# EAGLE design AD1865.2 (EAGLE 5.07)
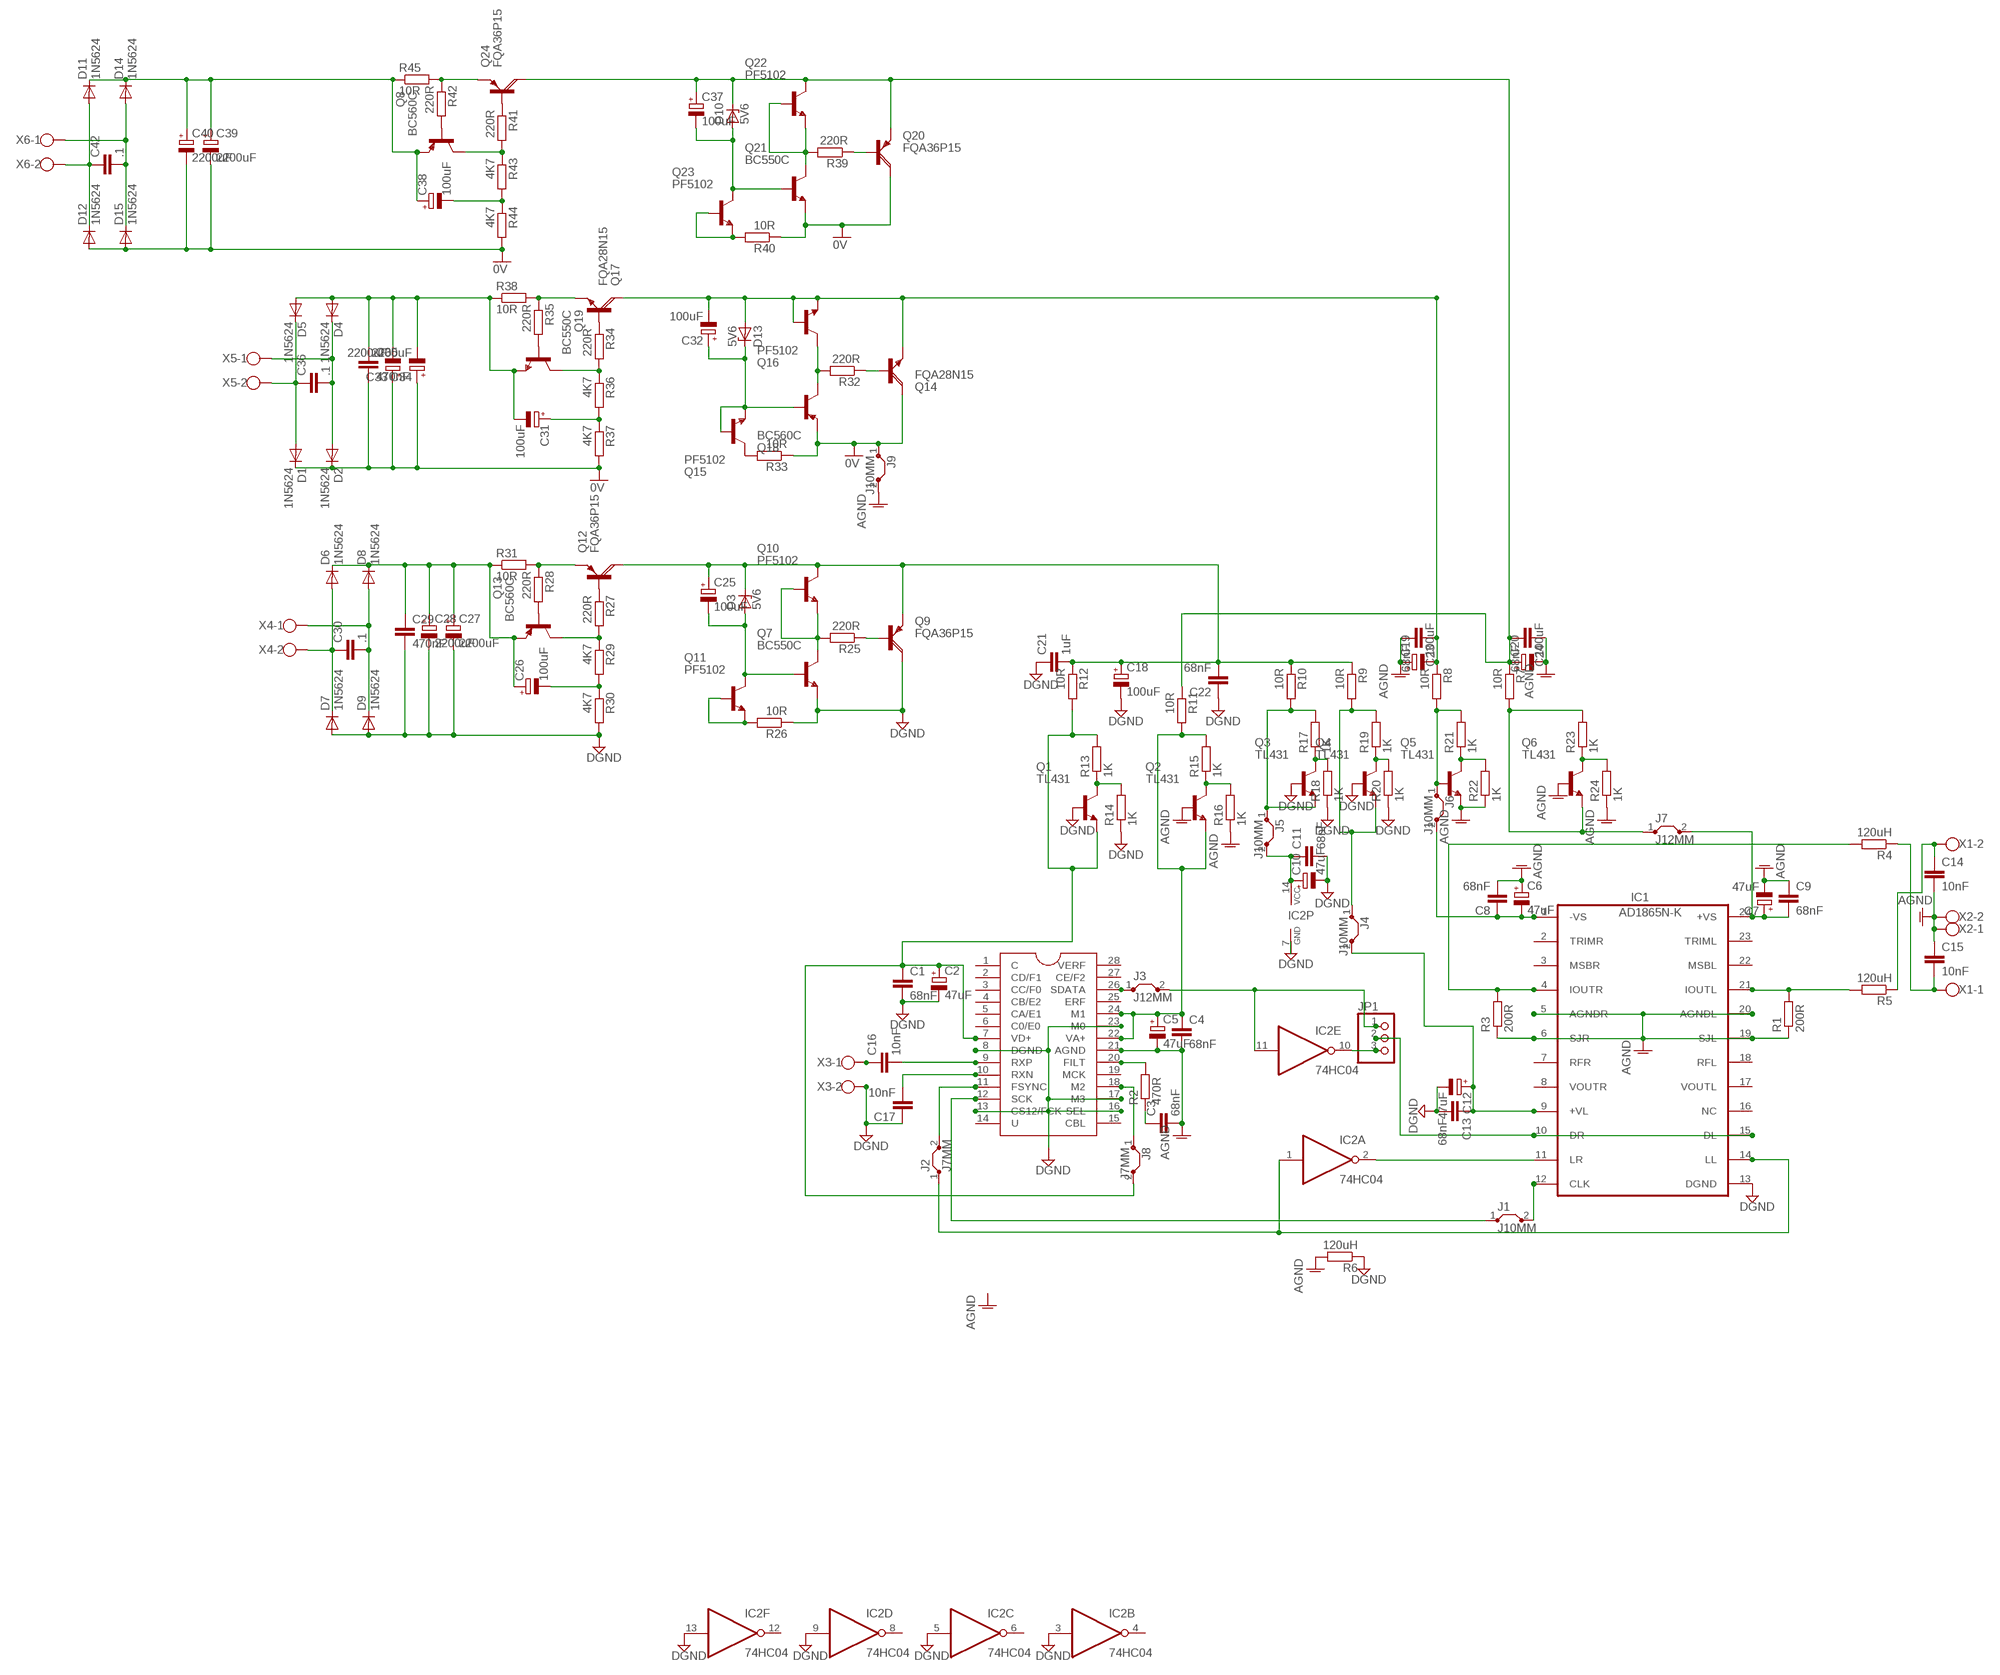
[diagram p0: schematic, sheet 1]

## Parts
C1  68nF  C-EU050-035X075  [C050-035X075]
C2  47uF  CPOL-EUTAP5-80  [TAP5-80]
C3  68nF  C-EU050-035X075  [C050-035X075]
C4  68nF  C-EU050-035X075  [C050-035X075]
C5  47uF  CPOL-EUTAP5-80  [TAP5-80]
C6  47uF  CPOL-EUTAP5-80  [TAP5-80]
C7  47uF  CPOL-EUTAP5-80  [TAP5-80]
C8  68nF  C-EU050-035X075  [C050-035X075]
C9  68nF  C-EU050-035X075  [C050-035X075]
C10  47uF  CPOL-EUTAP5-80  [TAP5-80]
C11  68nF  C-EU050-035X075  [C050-035X075]
C12  47uF  CPOL-EUTAP5-80  [TAP5-80]
C13  68nF  C-EU050-035X075  [C050-035X075]
C14  10nF  C-EU150-072X183  [C150-072X183]
C15  10nF  C-EU150-072X183  [C150-072X183]
C16  10nF  C-EU102-043X133  [C102-043X133]
C17  10nF  C-EU102-043X133  [C102-043X133]
C18  100uF  CPOL-EUE7.5-16  [E7,5-16]
C19  100uF  CPOL-EUE7.5-16  [E7,5-16]
C20  100uF  CPOL-EUE7.5-16  [E7,5-16]
C21  1uF  C-EU275-093X316  [C275-093X316]
C22  68nF  C-EU050-035X075  [C050-035X075]
C23  68nF  C-EU050-035X075  [C050-035X075]
C24  68nF  C-EU050-035X075  [C050-035X075]
C25  100uF  CPOL-EUTAP5-80  [TAP5-80]
C26  100uF  CPOL-EUTAP5-80  [TAP5-80]
C27  2200uF  CPOL-EUE10-20  [EB20D]
C28  2200uF  CPOL-EUE10-20  [EB20D]
C29  470nF  C-EU102-043X133  [C102-043X133]
C30  .1  C-EU102-043X133  [C102-043X133]
C31  100uF  CPOL-EUTAP5-80  [TAP5-80]
C32  100uF  CPOL-EUTAP5-80  [TAP5-80]
C33  2200uF  CPOL-EUE10-20  [EB20D]
C34  2200uF  CPOL-EUE10-20  [EB20D]
C35  470nF  C-EU102-043X133  [C102-043X133]
C36  .1  C-EU102-043X133  [C102-043X133]
C37  100uF  CPOL-EUTAP5-80  [TAP5-80]
C38  100uF  CPOL-EUTAP5-80  [TAP5-80]
C39  2200uF  CPOL-EUE10-20  [EB20D]
C40  2200uF  CPOL-EUE10-20  [EB20D]
C42  .1  C-EU075-052X106  [C075-052X106]
D1  1N5624  [DO201-15]
D2  1N5624  [DO201-15]
D3  5V6  1N821  [DO35Z10]
D4  1N5624  [DO201-15]
D5  1N5624  [DO201-15]
D6  1N5624  [DO201-15]
D7  1N5624  [DO201-15]
D8  1N5624  [DO201-15]
D9  1N5624  [DO201-15]
D10  5V6  1N821  [DO35Z10]
D11  1N5624  [DO201-15]
D12  1N5624  [DO201-15]
D13  5V6  1N821  [DO35Z10]
D14  1N5624  [DO201-15]
D15  1N5624  [DO201-15]
IC1  AD1865N-K  AD1865  [DIL24-6]
IC2  74HC04  74HC04N  [DIL14]
J1  J10MM  [10]
J2  J7MM  [07]
J3  J12MM  [12]
J4  J10MM  [10]
J5  J10MM  [10]
J6  J10MM  [10]
J7  J12MM  [12]
J8  J7MM  [07]
J9  J10MM  [10]
JP1  PINHD-1X3  [1X03]
Q1  TL431  BC546A  [TO92-EBC]
Q2  TL431  BC546A  [TO92-EBC]
Q3  TL431  BC546A  [TO92-EBC]
Q4  TL431  BC546A  [TO92-EBC]
Q5  TL431  BC546A  [TO92-EBC]
Q6  TL431  BC546A  [TO92-EBC]
Q7  BC550C  BC550B  [TO92-EBC]
Q8  BC560C  [TO92-EBC]
Q9  FQA36P15  TIP147  [SOT93]
Q10  PF5102  BC550B  [TO92-EBC]
Q11  PF5102  BC550B  [TO92-EBC]
Q12  FQA36P15  TIP147  [SOT93]
Q13  BC560C  [TO92-EBC]
Q14  FQA28N15  TIP142  [SOT93]
Q15  PF5102  BC550B  [TO92-EBC]
Q16  PF5102  BC550B  [TO92-EBC]
Q17  FQA28N15  TIP142  [SOT93]
Q18  BC560C  [TO92-EBC]
Q19  BC550C  BC550B  [TO92-EBC]
Q20  FQA36P15  TIP147  [SOT93]
Q21  BC550C  BC550B  [TO92-EBC]
Q22  PF5102  BC550B  [TO92-EBC]
Q23  PF5102  BC550B  [TO92-EBC]
Q24  FQA36P15  TIP147  [SOT93]
R1  200R  R-EU_0309/12  [0309/12]
R2  470R  R-EU_0204/7  [0204/7]
R3  200R  R-EU_0309/12  [0309/12]
R4  120uH  R-EU_0309/12  [0309/12]
R5  120uH  R-EU_0309/12  [0309/12]
R6  120uH  R-EU_0309/12  [0309/12]
R7  10R  R-EU_0309/12  [0309/12]
R8  10R  R-EU_0309/12  [0309/12]
R9  10R  R-EU_0309/12  [0309/12]
R10  10R  R-EU_0309/12  [0309/12]
R11  10R  R-EU_0309/12  [0309/12]
R12  10R  R-EU_0309/12  [0309/12]
R13  1K  R-EU_0204/7  [0204/7]
R14  1K  R-EU_0204/7  [0204/7]
R15  1K  R-EU_0204/7  [0204/7]
R16  1K  R-EU_0204/7  [0204/7]
R17  1K  R-EU_0204/7  [0204/7]
R18  1K  R-EU_0204/7  [0204/7]
R19  1K  R-EU_0204/7  [0204/7]
R20  1K  R-EU_0204/7  [0204/7]
R21  1K  R-EU_0204/7  [0204/7]
R22  1K  R-EU_0204/7  [0204/7]
R23  1K  R-EU_0204/7  [0204/7]
R24  1K  R-EU_0204/7  [0204/7]
R25  220R  R-EU_0204/7  [0204/7]
R26  10R  R-EU_0204/7  [0204/7]
R27  220R  R-EU_0204/7  [0204/7]
R28  220R  R-EU_0204/7  [0204/7]
R29  4K7  R-EU_0204/7  [0204/7]
R30  4K7  R-EU_0207/10  [0207/10]
R31  10R  R-EU_0414/15  [0414/15]
R32  220R  R-EU_0204/7  [0204/7]
R33  10R  R-EU_0204/7  [0204/7]
R34  220R  R-EU_0204/7  [0204/7]
R35  220R  R-EU_0204/7  [0204/7]
R36  4K7  R-EU_0204/7  [0204/7]
R37  4K7  R-EU_0207/10  [0207/10]
R38  10R  R-EU_0414/15  [0414/15]
R39  220R  R-EU_0207/10  [0207/10]
R40  10R  R-EU_0204/7  [0204/7]
R41  220R  R-EU_0204/7  [0204/7]
R42  220R  R-EU_0204/7  [0204/7]
R43  4K7  R-EU_0204/7  [0204/7]
R44  4K7  R-EU_0207/10  [0207/10]
R45  10R  R-EU_0414/15  [0414/15]
U$1  CS8414  CS8414DIP  [DIL28]
X1  W237-02P  [W237-132]
X2  W237-02P  [W237-132]
X3  W237-02P  [W237-132]
X4  W237-02P  [W237-132]
X5  W237-02P  [W237-132]
X6  W237-02P  [W237-132]

## Nets
0V: C33.+ C34.+ C35.2 C39.- C40.- D1.C D2.C D12.A D15.A J9.1 Q14.C Q18.E Q20.C Q21.E R33.1 R37.2 R40.1 R44.2
AGND: C3.2 C4.2 C5.- C6.+ C7.- C8.2 C9.1 C14.2 C15.1 C19.+ C20.- C23.2 C24.1 IC1.5(AGNDR) IC1.6(SJR) IC1.19(SJL) IC1.20(AGNDL) J9.2 Q2.B Q5.E Q6.B R1.1 R3.1 R6.2 R16.1 R22.1 R24.1 U$1.21(AGND) X2.1 X2.2
DGND: C1.2 C2.- C10.- C11.2 C12.- C13.2 C17.1 C18.- C21.1 C22.1 C27.- C28.- C29.2 D7.A D9.A IC1.13(DGND) IC2.3(B:I) IC2.5(C:I) IC2.7(P:GND) IC2.9(D:I) IC2.13(F:I) Q1.B Q3.B Q4.B Q7.E Q9.C R6.1 R14.1 R18.1 R20.1 R26.1 R30.2 U$1.8(DGND) U$1.13(CS12/FCK) U$1.16(SEL) U$1.17(M3) U$1.23(M0) X3.2
N$1: R2.2 U$1.20(FILT)
N$2: IC1.10(DR) IC1.15(DL) JP1.2
N$3: C3.1 R2.1
N$5: IC1.11(LR) IC2.2(A:O)
N$6: IC1.14(LL) IC2.1(A:I) J2.1
N$7: J1.1 U$1.12(SCK)
N$8: IC1.12(CLK) J1.2
N$9: J2.2 U$1.11(FSYNC)
N$10: IC2.11(E:I) J3.2 JP1.1
N$11: IC2.10(E:O) JP1.3
N$12: J5.1 Q3.E R10.2 R17.2
N$13: C19.- C23.1 C32.- D13.A Q14.E Q16.B Q16.E Q17.C R8.1
N$14: J3.1 U$1.26(SDATA)
N$15: C6.- C8.1 IC1.1(-VS) J6.2
N$16: C7.+ C9.2 IC1.24(+VS) J7.2
N$17: C1.1 C2.+ J8.2 Q1.E R12.2 R13.2 U$1.7(VD+)
N$18: IC1.21(IOUTL) R1.2 R5.2
N$19: C10.+ C11.1 IC2.14(P:VCC) J5.2
N$20: IC1.4(IOUTR) R3.2 R4.2
N$21: C14.1 R5.1 X1.2
N$22: C15.2 R4.1 X1.1
N$23: C17.2 U$1.10(RXN)
N$24: C16.2 U$1.9(RXP)
N$25: C16.1 X3.1
N$26: C12.+ C13.1 IC1.9(+VL) J4.2
N$27: J7.1 Q6.E R7.2 R23.2
N$28: J6.1 Q5.B R8.2 R21.2
N$29: Q5.C R21.1 R22.2
N$30: J8.1 U$1.18(M2)
N$31: Q1.C R13.1 R14.2
N$32: C4.1 C5.+ Q2.E R11.2 R15.2 U$1.22(VA+) U$1.24(M1)
N$33: Q2.C R15.1 R16.2
N$34: Q3.C R17.1 R18.2
N$35: Q8.B R42.2
N$36: Q4.C R19.1 R20.2
N$37: Q6.C R23.1 R24.2
N$38: C20.+ C24.2 C37.+ D10.C Q20.E Q22.C Q24.C R7.1 R11.1
N$39: C18.+ C21.2 C22.2 C25.+ D3.C Q9.E Q10.C Q12.C R9.1 R10.1 R12.1
N$40: Q9.B R25.1
N$41: Q17.E R35.1 R38.2
N$42: Q12.E R28.1 R31.2
N$43: Q7.C Q10.B Q10.E R25.2
N$44: C25.- D3.A Q7.B Q11.C
N$45: Q11.B Q11.E R26.2
N$46: Q12.B R27.1
N$47: Q17.B R34.1
N$48: Q13.C R27.2 R29.1
N$49: Q13.B R28.2
N$50: C26.- R29.2 R30.1
N$51: C26.+ C27.+ C28.+ C29.1 D6.C D8.C Q13.E R31.1
N$52: C30.2 D8.A D9.C X4.1
N$53: C30.1 D6.A D7.C X4.2
N$54: Q19.B R35.2
N$55: Q14.B R32.1
N$56: Q19.C R34.2 R36.1
N$57: Q16.C Q18.C R32.2
N$58: C32.+ D13.C Q15.B Q15.E Q18.B
N$59: Q15.C R33.2
N$60: C31.- C33.- C34.- C35.1 D4.A D5.A Q19.E R38.1
N$61: C31.+ R36.2 R37.1
N$62: J4.1 Q4.E R9.2 R19.2
N$63: C36.2 D2.A D4.C X5.1
N$64: C36.1 D1.A D5.C X5.2
N$65: Q20.B R39.1
N$66: Q21.C Q22.B Q22.E R39.2
N$67: C37.- D10.A Q21.B Q23.C
N$68: Q23.B Q23.E R40.2
N$69: Q24.E R42.1 R45.2
N$70: Q24.B R41.1
N$71: Q8.C R41.2 R43.1
N$73: C38.- R43.2 R44.1
N$74: C38.+ C39.+ C40.+ D11.C D14.C Q8.E R45.1
N$75: C42.2 D14.A D15.C X6.1
N$76: C42.1 D11.A D12.C X6.2
Unconnected: IC1.2(TRIMR) IC1.3(MSBR) IC1.7(RFR) IC1.8(VOUTR) IC1.16(NC) IC1.17(VOUTL) IC1.18(RFL) IC1.22(MSBL) IC1.23(TRIML) IC2.4(B:O) IC2.6(C:O) IC2.8(D:O) IC2.12(F:O) U$1.1(C) U$1.2(CD/F1) U$1.3(CC/F0) U$1.4(CB/E2) U$1.5(CA/E1) U$1.6(C0/E0) U$1.14(U) U$1.15(CBL) U$1.19(MCK) U$1.25(ERF) U$1.27(CE/F2) U$1.28(VERF)

## Library data of the parts
C1 C3 C4 C8 C9 C11 C13-C17 C21-C24 C29 C30 C35 C36 C42 = resistor:C-EU: CAPACITOR, European symbol
C2 C5-C7 C10 C12 C18-C20 C25-C28 C31-C34 C37-C40 = resistor:CPOL-EU: POLARIZED CAPACITOR, European symbol
D1 D2 D4-D9 D11 D12 D14 D15 = diode:1N5624: DIODE controlled avalanche rectifier
D3 D10 D13 = diode:1N821: Reference DIODE temperature compensated, 6,2 V
IC1 = pavouk:AD1865: Complete Dual 18-Bit 16xFS Audio DAC
IC2 = 74xx-eu:74*04: Hex INVERTER
J1-J9 = jumper:J: Bridge
JP1 = pinhead:PINHD-1X3: PIN HEADER
Q1-Q6 = transistor-npn:BC546*: NPN Transistor
Q7 Q10 Q11 Q15 Q16 Q19 Q21-Q23 = transistor-npn:BC550*: NPN Transistor
Q8 Q13 Q18 = transistor-pnp:BC560*: PNP Transistror
Q9 Q12 Q20 Q24 = transistor-power:TIP147: PNP DARLINGTON TRANSISTOR
Q14 Q17 = transistor-power:TIP142: NPN DARLINGTON TRANSISTOR
R1-R45 = resistor:R-EU_: RESISTOR, European symbol
U$1 = cirrus-dar:CS8414: 24bit 96kHz Digital Audio Receiver
X1-X6 = con-wago-508:W237-02P: WAGO SREW CLAMP

## Board
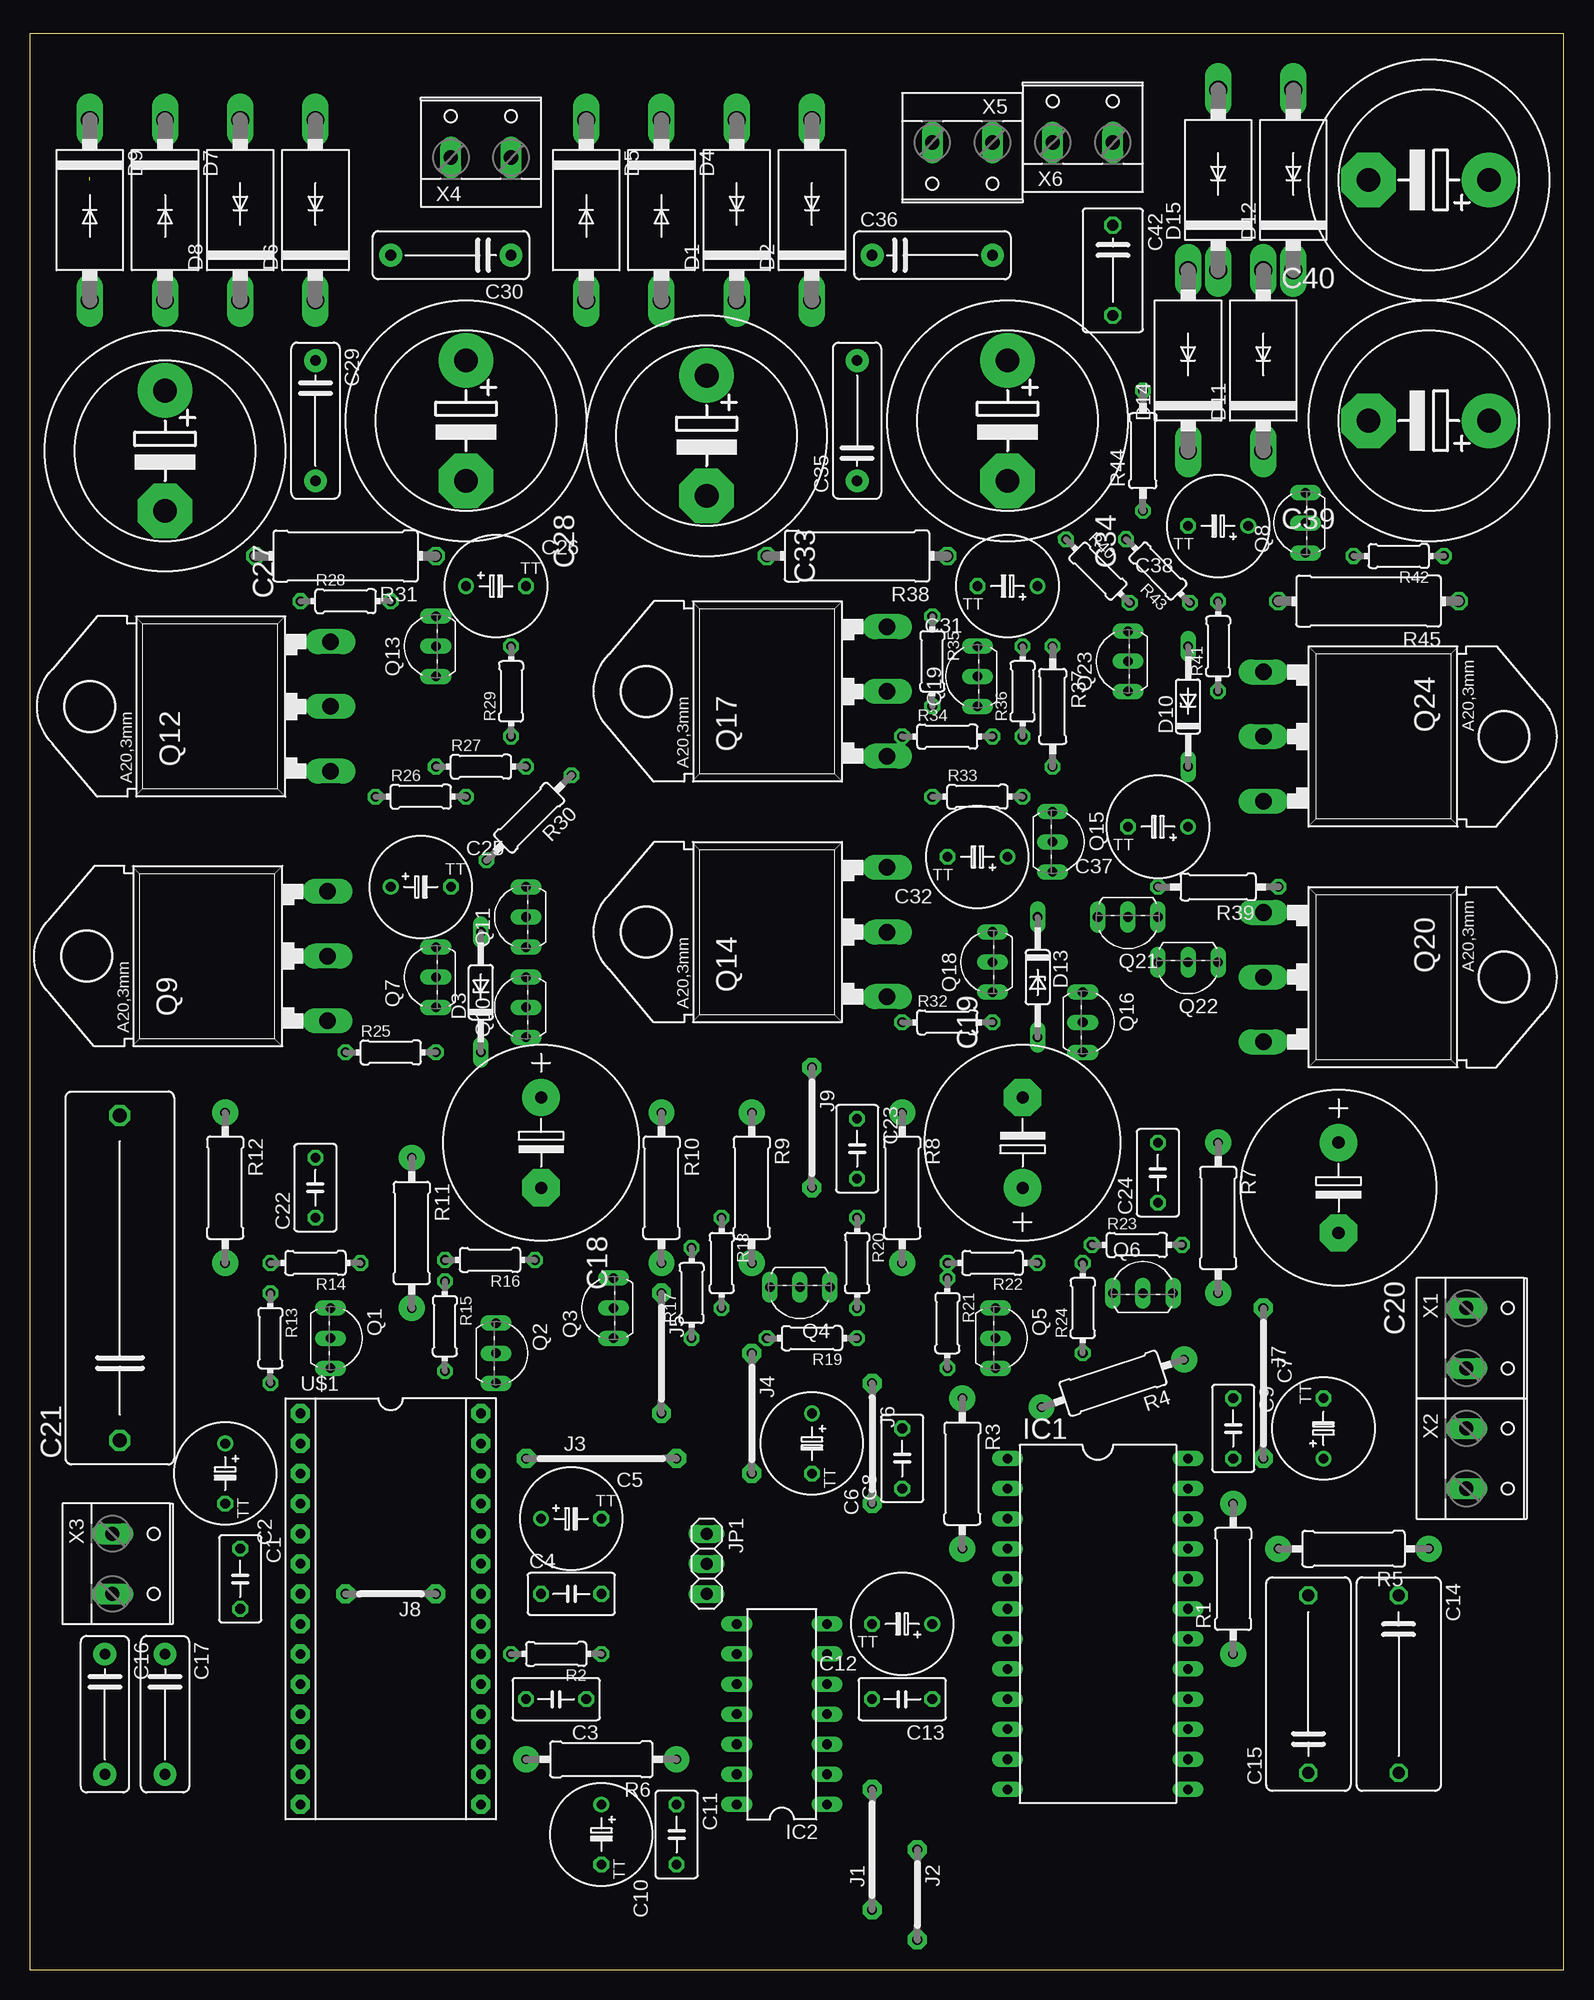
[diagram p1: board, top side]
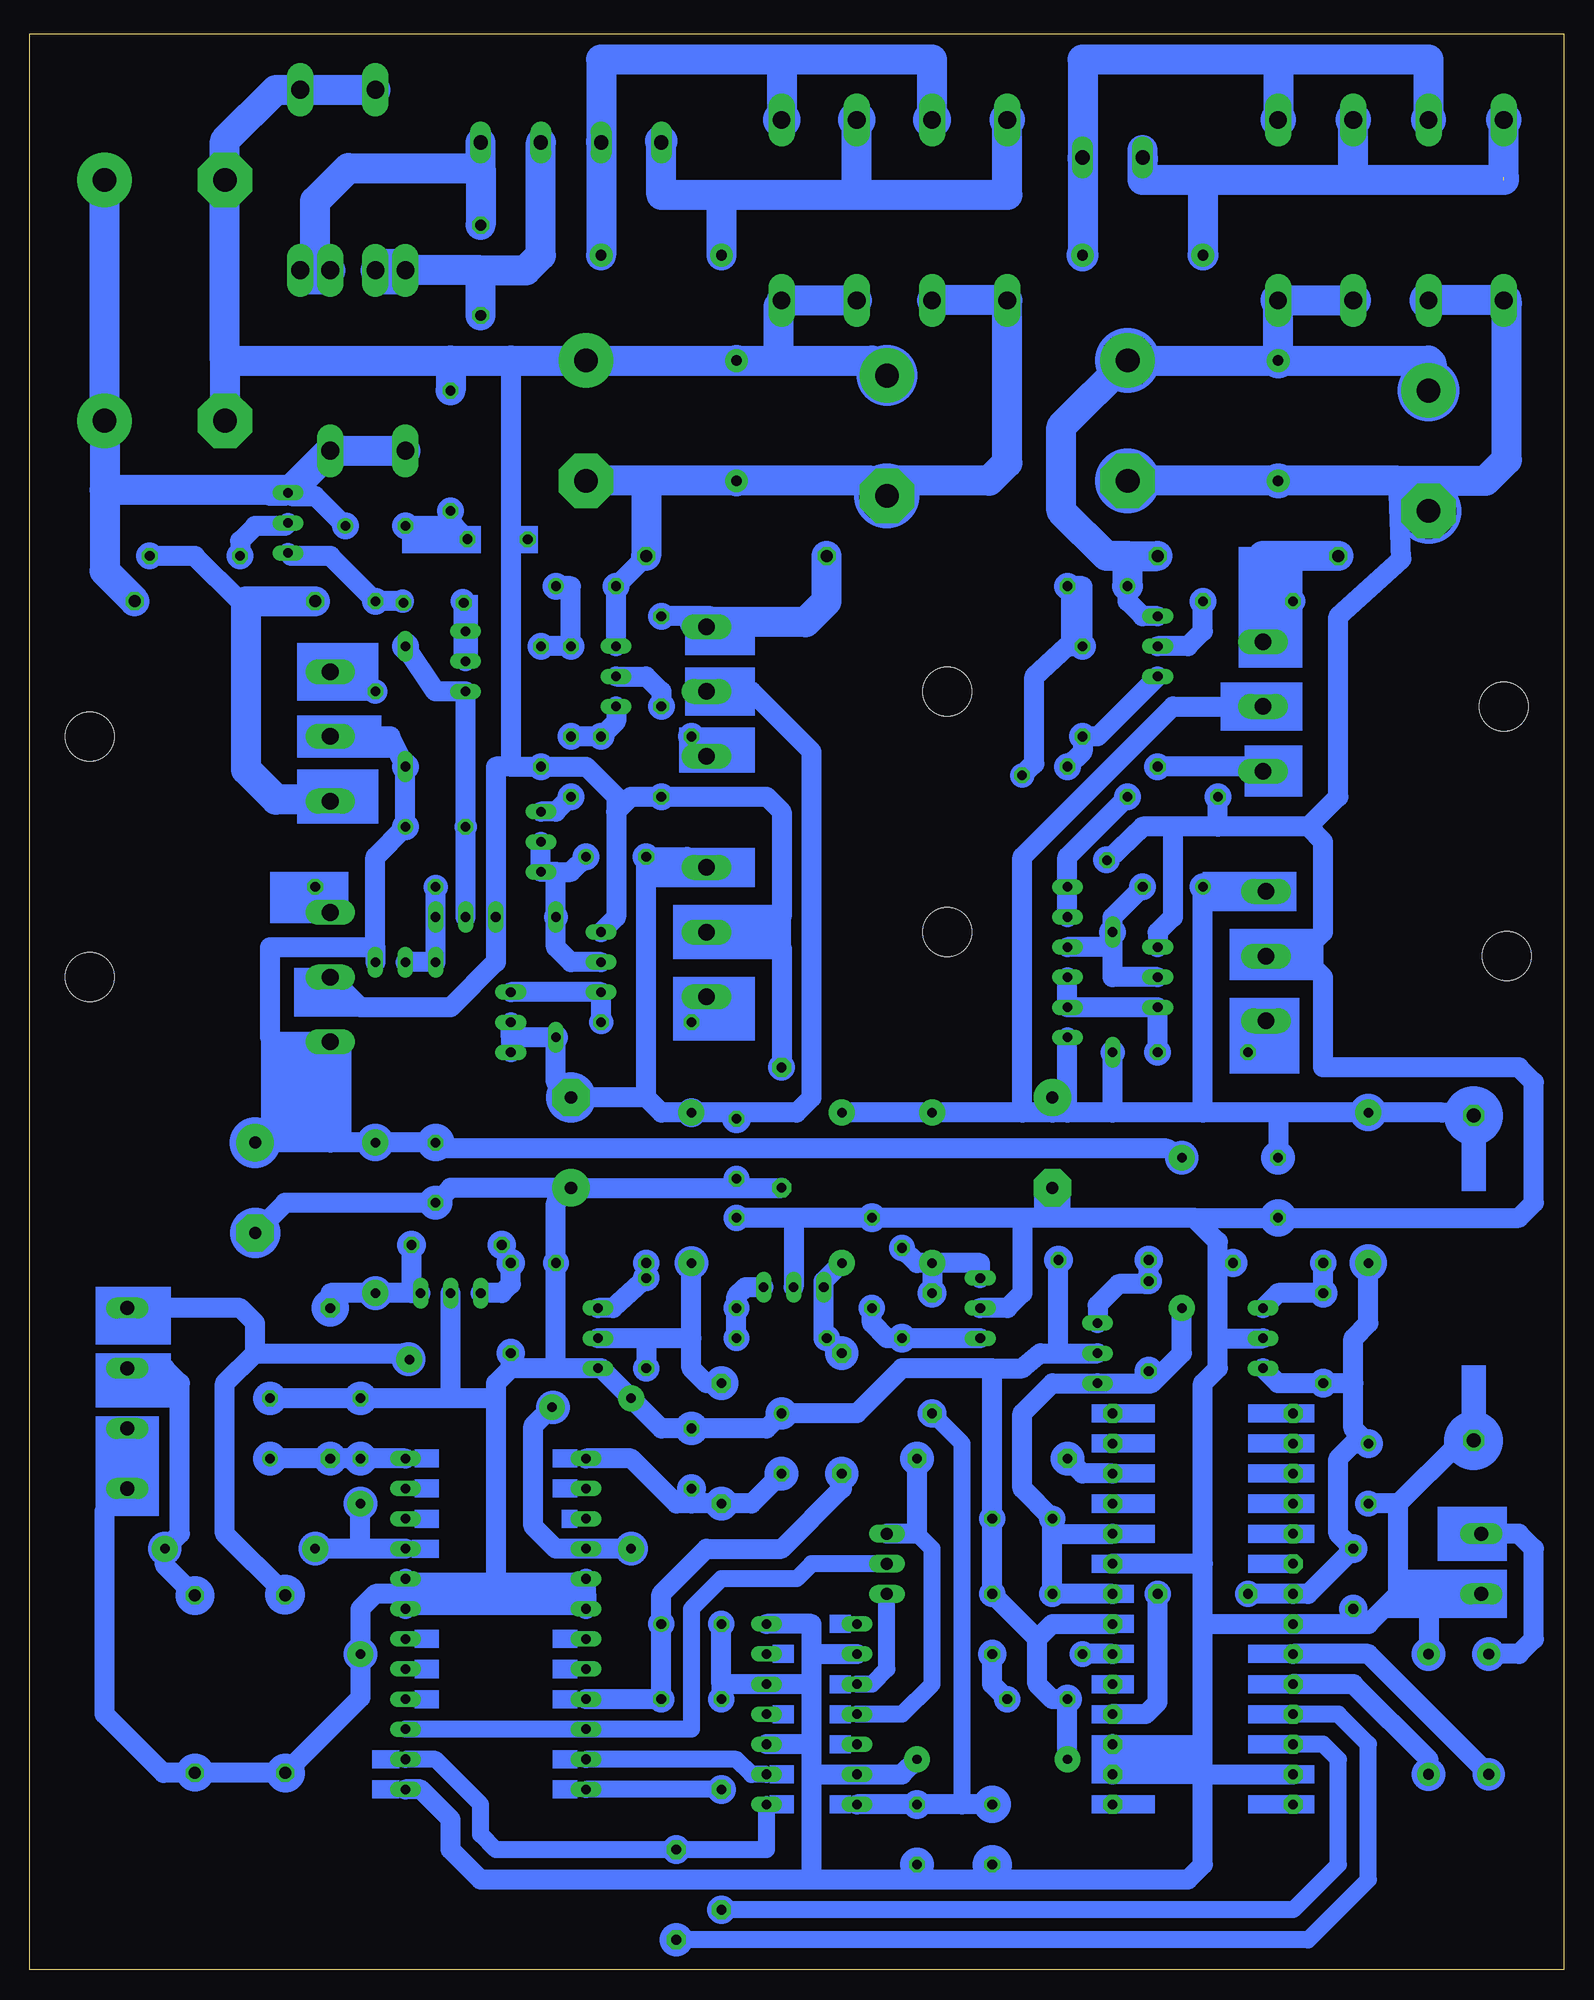
[diagram p2: board, bottom side, seen from below]

Size 129.52 x 163.5 mm. Coordinates in mm from the lower left corner, seen from the top.
Outline: 0,0 129.52,0 129.52,163.5 0,163.5 0,0
Copper layers (1*16): Top 0.035mm / dielectric 1.5mm / Bottom 0.035mm
Design rules "default": minimum track width 10mil, minimum drill 24mil, track to track 8mil, track to pad 8mil, pad to pad 8mil, via to via 8mil, smd to smd 8mil, copper to edge 40mil, drill to drill 8mil, minimum pad ring 10mil, minimum via ring 8mil, stop-mask expansion 4mil, vias tented up to drill 0mil, thermal gap 10mil

### Footprints (pad centres in the part's own frame; a part is rotated, then mirrored left to right if it is on the bottom)
C050-035X075 = drill 0.813 octagon: 1 -2.54,0; 2 2.54,0
TAP5-80 = drill 0.813: + -2.54,0 | drill 0.813 octagon: - 2.54,0
C150-072X183 = drill 1.016 octagon: 1 -7.493,0; 2 7.493,0
C102-043X133 = drill 0.9 pad 1.93: 1 -5.08,0; 2 5.08,0
E7,5-16 = drill 1.016 pad 3.15: + -3.81,0 | drill 1.016 pad 3.15 octagon: - 3.81,0
C275-093X316 = drill 1.194 octagon: 1 -13.716,0; 2 13.716,0
EB20D = drill 2.007 pad 4.597: + -5.08,0 | drill 2.007 pad 4.597 octagon: - 5.08,0
C075-052X106 = drill 0.914 octagon: 1 -3.81,0; 2 3.81,0
DO201-15 = drill 1.499 long: A 7.62,0; C -7.62,0
DO35Z10 = drill 0.813 long: A 5.08,0; C -5.08,0
DIL24-6 = drill 0.813 long: 1 -13.97,-7.62; 2 -11.43,-7.62; 3 -8.89,-7.62; 4 -6.35,-7.62; 5 -3.81,-7.62; 6 -1.27,-7.62; 7 1.27,-7.62; 8 3.81,-7.62; 9 6.35,-7.62; 10 8.89,-7.62; 11 11.43,-7.62; 12 13.97,-7.62; 13 13.97,7.62; 14 11.43,7.62; 15 8.89,7.62; 16 6.35,7.62; 17 3.81,7.62; 18 1.27,7.62; 19 -1.27,7.62; 20 -3.81,7.62; 21 -6.35,7.62; 22 -8.89,7.62; 23 -11.43,7.62; 24 -13.97,7.62
DIL14 = drill 0.813 long: 1 -7.62,-3.81; 2 -5.08,-3.81; 3 -2.54,-3.81; 4 0,-3.81; 5 2.54,-3.81; 6 5.08,-3.81; 7 7.62,-3.81; 8 7.62,3.81; 9 5.08,3.81; 10 2.54,3.81; 11 0,3.81; 12 -2.54,3.81; 13 -5.08,3.81; 14 -7.62,3.81
10 = drill 0.813 pad 1.6 octagon: 1 -5.08,0; 2 5.08,0
07 = drill 0.813 pad 1.6 octagon: 1 -3.81,0; 2 3.81,0
12 = drill 0.813 pad 1.6 octagon: 1 -6.35,0; 2 6.35,0
1X03 = drill 1.016 long: 1 -2.54,0; 2 0,0; 3 2.54,0
TO92-EBC = drill 0.813 long: B 0,-1.27; C -2.54,-1.27; E 2.54,-1.27
SOT93 = drill 1.397 long: B -5.461,-10.16; C 0,-10.16; E 5.461,-10.16 | hole 4.115: 0,10.16
0309/12 = drill 0.8 pad 2.184: 1 -6.35,0; 2 6.35,0
0204/7 = drill 0.813 octagon: 1 -3.81,0; 2 3.81,0
0207/10 = drill 0.813 octagon: 1 -5.08,0; 2 5.08,0
0414/15 = drill 1.016 octagon: 1 -7.62,0; 2 7.62,0
DIL28 = drill 0.813 pad 1.6 octagon: 1 -16.51,-7.62; 2 -13.97,-7.62; 3 -11.43,-7.62; 4 -8.89,-7.62; 5 -6.35,-7.62; 6 -3.81,-7.62; 7 -1.27,-7.62; 8 1.27,-7.62; 9 3.81,-7.62; 10 6.35,-7.62; 11 8.89,-7.62; 12 11.43,-7.62; 13 13.97,-7.62; 14 16.51,-7.62; 15 16.51,7.62; 16 13.97,7.62; 17 11.43,7.62; 18 8.89,7.62; 19 6.35,7.62; 20 3.81,7.62; 21 1.27,7.62; 22 -1.27,7.62; 23 -3.81,7.62; 24 -6.35,7.62; 25 -8.89,7.62; 26 -11.43,7.62; 27 -13.97,7.62; 28 -16.51,7.62
W237-132 = drill 1.194 long: 1 -2.54,-0.635; 2 2.54,-0.635

### Placement (x,y rotation side)
C1  17.78,33.02 270 top
C2  16.51,41.91 270 top
C3  44.45,22.86 180 top
C4  45.72,31.75 0 top
C5  45.72,38.1 0 top
C6  66.04,44.45 270 top
C7  109.22,45.72 90 top
C8  73.66,43.18 90 top
C9  101.6,45.72 270 top
C10  48.26,11.43 270 top
C11  54.61,11.43 270 top
C12  73.66,29.21 180 top
C13  73.66,22.86 180 top
C14  115.57,24.13 270 top
C15  107.95,24.13 90 top
C16  6.35,21.59 270 top
C17  11.43,21.59 270 top
C18  43.18,69.85 270 top
C19  83.82,69.85 90 top
C20  110.49,66.04 270 top
C21  7.62,58.42 90 top
C22  24.13,66.04 90 top
C23  69.85,69.34 270 top
C24  95.25,67.31 90 top
C25  33.02,91.44 0 top
C26  39.37,116.84 0 top
C27  11.43,128.27 270 top
C28  36.83,130.81 270 top
C29  24.13,130.81 270 top
C30  35.56,144.78 180 top
C31  82.55,116.84 180 top
C32  80.01,93.98 180 top
C33  57.15,129.54 270 top
C34  82.55,130.81 270 top
C35  69.85,130.81 90 top
C36  76.2,144.78 0 top
C37  95.25,96.52 180 top
C38  100.33,121.92 180 top
C39  118.11,130.81 180 top
C40  118.11,151.13 180 top
C42  91.44,143.51 270 top
D1  59.69,148.59 90 top
D2  66.04,148.59 90 top
D3  38.1,82.55 90 top
D4  53.34,148.59 270 top
D5  46.99,148.59 270 top
D6  24.13,148.59 90 top
D7  11.43,148.59 270 top
D8  17.78,148.59 90 top
D9  5.08,148.59 270 top
D10  97.79,106.68 90 top
D11  104.14,135.89 90 top
D12  106.68,151.13 90 top
D13  85.09,83.82 270 top
D14  97.79,135.89 90 top
D15  100.33,151.13 90 top
IC1  90.17,29.21 270 top
IC2  63.5,21.59 90 top
J1  71.12,10.16 90 top
J2  74.93,6.35 270 top
J3  48.26,43.18 0 top
J4  60.96,46.99 270 top
J5  53.34,52.07 270 top
J6  71.12,44.45 270 top
J7  104.14,49.53 270 top
J8  30.48,31.75 180 top
J9  66.04,71.12 270 top
JP1  57.15,34.29 270 top
Q1  26.67,53.34 270 top
Q2  40.64,52.07 270 top
Q3  48.01,55.88 90 top
Q4  65.02,56.39 180 top
Q5  82.8,53.34 270 top
Q6  93.98,58.42 0 top
Q7  33.02,83.82 90 top
Q8  106.43,122.17 90 top
Q9  14.99,85.6 90 top
Q10  40.64,81.28 90 top
Q11  40.64,88.9 90 top
Q12  15.24,106.68 90 top
Q13  33.02,111.76 90 top
Q14  62.23,87.63 90 top
Q15  87.63,95.25 270 top
Q16  90.17,80.01 270 top
Q17  62.23,107.95 90 top
Q18  80.01,85.09 90 top
Q19  78.74,109.22 90 top
Q20  114.3,83.82 270 top
Q21  92.71,87.63 180 top
Q22  97.79,83.82 180 top
Q23  91.44,110.49 90 top
Q24  114.3,104.14 270 top
R1  101.6,33.02 90 top
R2  44.45,26.67 180 top
R3  78.74,41.91 270 top
R4  91.44,49.53 198.5 top
R5  111.76,35.56 180 top
R6  48.26,17.78 180 top
R7  100.33,63.5 270 top
R8  73.66,66.04 270 top
R9  60.96,66.04 270 top
R10  53.34,66.04 270 top
R11  32.26,62.23 270 top
R12  16.51,66.04 270 top
R13  20.32,53.34 270 top
R14  24.13,59.69 180 top
R15  35.05,54.36 270 top
R16  38.86,59.94 180 top
R17  55.88,57.15 90 top
R18  58.42,59.69 270 top
R19  66.04,53.34 180 top
R20  69.85,59.69 270 top
R21  77.47,54.61 270 top
R22  81.28,59.69 180 top
R23  93.47,61.21 0 top
R24  88.9,55.88 90 top
R25  30.48,77.47 0 top
R26  33.02,99.06 0 top
R27  38.1,101.6 0 top
R28  26.67,115.57 0 top
R29  40.64,107.95 90 top
R30  42.16,97.28 225 top
R31  26.67,119.38 180 top
R32  77.47,80.01 0 top
R33  80.01,99.06 0 top
R34  77.47,104.14 0 top
R35  76.2,110.49 270 top
R36  83.82,107.95 90 top
R37  86.36,106.68 270 top
R38  69.85,119.38 180 top
R39  100.33,91.44 180 top
R40  90.17,118.11 315.1 top
R41  100.33,111.76 90 top
R42  115.57,119.38 180 top
R43  95.25,118.11 135 top
R44  93.98,128.27 90 top
R45  113.03,115.57 180 top
U$1  30.48,30.48 270 top
X1  121.92,53.34 270 top
X2  121.92,43.18 270 top
X3  7.62,34.29 270 top
X4  38.1,153.67 0 top
X5  78.74,153.67 180 top
X6  88.9,154.94 0 top

### Tracks (layer width: path | path; a pad name or v marks a point on that pad's centre or on a via)
0V
  Bottom 1.676: 67.31,87.63 66.04,86.36 J9.1 | Q18.E 80.01,88.9 80.01,97.79 | 80.01,97.79 78.74,99.06 R33.1 67.31,99.06 66.04,97.79 66.04,88.9 67.31,87.63 | 67.31,87.63 Q14.C | 80.01,97.79 80.01,99.06 82.55,101.6 R37.2 88.9,101.6 | 88.9,120.65 88.9,101.6 | 88.9,135.89 88.9,120.65 | 58.42,135.89 C33.+ | Q20.C 101.6,81.28 93.98,81.28 90.17,85.09 Q21.E 90.17,101.6 88.9,101.6 | R40.1 87.62,120.65 88.9,120.65
  Bottom 2.54: 113.03,135.89 C40.- 113.03,154.43 108.71,158.75 D12.A D15.A | 113.03,135.89 C39.- | 65.79,140.97 D2.C | 66.29,135.89 C35.2 C34.+ 88.9,135.89 93.98,135.89 | 66.29,135.89 58.42,135.89 | 65.79,140.97 D1.C | 65.79,140.97 66.29,140.46 66.29,135.89 | 113.03,135.89 93.98,135.89 | 93.98,135.89 R44.2
AGND
  Bottom 1.676: 82.55,31.75 IC1.6 | 97.79,31.75 IC1.19 | 97.79,31.75 IC1.20 | 82.55,31.75 IC1.5 | 90.17,31.75 82.55,31.75 | 90.17,31.75 97.79,31.75 | C7.- C9.1 93.98,48.26 | 90.17,48.26 90.17,31.75 | 97.79,31.75 100.33,31.75 101.6,30.48 R1.1 101.6,22.99 C15.1 C14.2 118.24,16.64 123.19,21.59 123.19,38.73 X2.2 X2.1 | R6.2 C3.2 43.18,22.86 44.45,24.13 44.45,27.94 | 85.09,50.8 88.9,50.8 | 90.17,48.26 93.98,48.26 | 48.26,50.8 C5.- C4.2 44.45,27.94 | 48.26,50.8 55.88,50.8 59.69,46.99 C6.+ 67.31,45.72 C8.2 76.2,45.72 R3.1 81.28,50.8 Q5.E 85.09,50.8 | 85.09,50.8 R22.1 85.09,64.77 C19.+ | C20.- 107.95,64.77 C24.1 93.98,66.04 C19.+ | U$1.21 43.18,29.21 44.45,27.94 | 88.9,50.8 90.17,49.53 90.17,48.26 | 48.26,50.8 45.72,50.8 44.2,52.07 42.67,52.07 | C19.+ 69.34,66.04 | 69.34,66.04 C23.2 | 69.34,66.04 J9.2 | 42.67,52.07 Q2.B | 42.67,52.07 R16.1 | 88.9,50.8 R24.1 | 93.98,48.26 Q6.B
DGND
  Bottom 1.422: C2.- 15.24,39.37
  Bottom 1.676: 30.48,34.29 U$1.23 | 30.48,16.51 30.48,29.21 | 30.48,29.21 30.48,34.29 | 30.48,16.51 U$1.16 U$1.17 | 30.48,16.51 U$1.13 | 30.48,29.21 U$1.8 17.78,29.21 | IC1.13 96.52,15.24 93.98,12.7 93.98,10.16 91.44,7.62 63.5,7.62 | 48.26,7.62 31.75,7.62 30.48,8.89 30.48,16.51 | 48.26,7.62 54.61,7.62 | 54.61,7.62 63.5,7.62 | 48.26,7.62 C10.- | 54.61,7.62 C11.2 | 13.97,31.75 11.43,31.75 | 11.43,31.75 X3.2 | 13.97,31.75 16.51,29.21 17.78,29.21 | 11.43,31.75 C17.1 | 17.78,29.21 C1.2 | 30.48,34.29 30.48,49.53 29.21,50.8 29.21,53.34 | 43.18,63.5 C18.- | 43.18,63.5 45.72,63.5 | C21.1 8.89,44.45 13.97,39.37 | 13.97,39.37 C2.- | 13.97,31.75 13.97,39.37 | 71.12,24.13 C12.- | 71.12,24.13 IC2.5 63.5,24.13 | 71.12,24.13 C13.2 | R6.1 55.88,16.51 IC2.13 63.5,16.51 | 63.5,26.67 IC2.9 | 63.5,16.51 63.5,19.05 | 63.5,24.13 63.5,26.67 | 63.5,19.05 63.5,24.13 | 63.5,19.05 IC2.3 | 63.5,7.62 63.5,16.51 | IC2.7 63.5,29.21 63.5,26.67 | 29.21,53.34 29.21,59.69 | 29.21,59.69 29.21,61.47 31.24,63.5 | 31.24,63.5 43.18,63.5 | 31.24,63.5 C22.1 3.81,63.5 2.54,64.77 2.54,74.93 3.81,76.2 20.32,76.2 20.32,83.82 22.1,85.6 Q9.C 22.35,85.6 20.32,87.63 20.32,95.25 21.59,96.52 | Q7.E 34.29,87.63 33.02,88.9 33.02,96.52 | 21.59,96.52 29.21,96.52 | 29.21,96.52 33.02,96.52 | 29.21,96.52 R26.1 | 21.59,96.52 19.05,99.06 19.05,114.3 13.72,119.13 13.97,125.73 | R30.2 35.56,96.52 33.02,96.52 | 11.43,125.73 C27.- | 29.21,53.34 Q1.B | 29.21,59.69 R14.1 | Q3.B 46.99,55.88 45.72,57.15 45.72,63.5 | 45.72,63.5 R18.1 65.02,63.5 | 65.02,63.5 Q4.B | 65.02,63.5 R20.1
  Bottom 2.54: D7.A D9.A 4.83,140.72 4.83,127.51 6.6,125.73 11.43,125.73 13.97,125.73 C29.2 C28.-
N$1
  Bottom 1.676: U$1.20 R2.2
N$2
  Bottom 1.422: IC1.15 IC1.10 73.66,20.32 73.66,30.48 71.12,33.02 64.77,33.02 63.5,34.29 JP1.2
N$3
  Bottom 1.676: C3.1 48.26,24.13 R2.1
N$5
  Bottom 1.422: IC2.2 68.58,16.51 69.85,17.78 IC1.11
N$6
  Bottom 1.422: IC2.1 67.31,10.16 J2.1 90.17,10.16 91.44,11.43 91.44,13.97 95.25,17.78 IC1.14
N$7
  Bottom 1.422: U$1.12 20.32,19.05 19.05,17.78 19.05,8.89 22.86,5.08 J1.1
N$8
  Bottom 1.422: J1.2 IC1.12
N$9
  Bottom 1.422: U$1.11 19.05,21.59 16.51,19.05 16.51,7.62 21.59,2.54 J2.2
N$10
  Bottom 1.422: 54.61,36.83 53.34,35.56 53.34,24.13 55.88,21.59 IC2.11
  Bottom 1.676: J3.2 54.61,36.83 JP1.1
N$11
  Bottom 1.422: JP1.3 57.15,25.4 58.42,24.13 IC2.10
N$12
  Bottom 1.676: R10.2 49.28,59.69 Q3.E | R17.2 54.61,59.69 R10.2 | R10.2 J5.1
N$13
  Bottom 1.676: 77.47,73.66 76.2,72.39 R8.1 69.85,72.39 | 77.47,73.66 C19.- 85.09,74.93 D13.A 88.9,78.74 | Q14.E 74.04,93.98 C32.- 77.47,73.66 | 88.9,78.74 Q16.E | 88.9,78.74 Q16.B | 69.85,72.39 C23.1 | Q17.C 68.58,107.95 63.5,102.87 63.5,73.66 64.77,72.39 69.85,72.39
N$14
  Bottom 1.676: U$1.26 40.64,41.91 J3.1
N$15
  Bottom 1.676: IC1.1 78.74,43.18 74.93,39.37 73.66,39.37 | 73.66,39.37 J6.2 68.58,39.37 C6.- | 73.66,39.37 C8.1
N$16
  Bottom 1.676: IC1.24 C9.2 J7.2 C7.+
N$17
  Bottom 1.676: 17.78,49.53 17.78,45.72 C2.+ 17.78,44.45 19.05,43.18 19.05,36.83 C1.1 21.59,31.75 U$1.7 J8.2 | 17.78,49.53 17.78,53.34 16.51,54.61 R12.2 | 17.78,49.53 R13.2 24.13,49.53 Q1.E
N$18
  Bottom 1.676: IC1.21 101.6,35.56 | 101.6,35.56 R5.2 | 101.6,35.56 R1.2
N$19
  Bottom 1.422: 50.8,13.97 50.8,44.45 J5.2
  Bottom 1.676: C10.+ 50.8,13.97 C11.1 IC2.14
N$20
  Bottom 1.676: IC1.4 R3.2 85.09,35.56 86.99,37.47 86.99,45.94 R4.2
N$21
  Bottom 1.676: C14.1 118.11,34.16 R5.1 116.84,36.83 116.84,49.53 118.11,50.8 X1.2
N$22
  Bottom 1.676: R4.1 97.99,52.07 110.49,52.07 | 110.49,52.07 113.03,49.53 113.03,36.83 107.95,31.75 C15.2 | X1.1 111.76,55.88 110.49,54.61 110.49,52.07
N$23
  Bottom 1.676: C17.2 11.43,17.78 17.78,24.13 U$1.10
N$24
  Bottom 1.676: U$1.9 16.51,26.67 C16.2
N$25
  Bottom 1.676: X3.1 3.81,36.83 2.54,35.56 2.54,27.94 3.81,26.67 C16.1
N$26
  Bottom 1.676: IC1.9 C13.1 C12.+ 76.2,31.75 72.39,35.56 66.04,35.56 60.96,40.64 J4.2
N$27
  Bottom 1.676: 97.28,57.15 R23.2 | 97.28,57.15 R7.2 104.14,57.15 J7.1 | Q6.E 97.28,57.15
N$28
  Bottom 1.676: 73.66,53.34 77.47,53.34 | 73.66,53.34 R8.2 | J6.1 72.39,49.53 73.66,50.8 73.66,53.34 | 77.47,53.34 R21.2 | 77.47,53.34 Q5.B
N$29
  Bottom 1.676: R22.2 R21.1 80.26,55.88 Q5.C
N$30
  Bottom 1.676: J8.1 34.29,22.61 35.31,21.59 U$1.18
N$31
  Bottom 1.676: R14.2 R13.1 24.13,57.15 Q1.C
N$32
  Bottom 1.676: U$1.22 C4.1 43.18,36.83 | 43.18,36.83 C5.+ 45.72,40.64 45.72,46.99 43.18,49.53 Q2.E 35.31,49.53 | 43.18,36.83 U$1.24 | R11.2 32.26,52.07 34.8,49.53 35.31,49.53 | R15.2 35.31,50.29 35.31,49.53
N$33
  Bottom 1.676: R16.2 R15.1 35.31,57.91 37.59,57.91 39.37,56.13 Q2.C
N$34
  Bottom 1.676: Q3.C R17.1 57.15,53.34 58.42,54.61 R18.2
N$35
  Bottom 1.676: Q8.B 107.95,121.92 110.49,121.92 111.76,120.65 R42.2
N$36
  Bottom 1.676: R19.1 R20.2 69.85,56.9 69.09,57.66 Q4.C
N$37
  Bottom 1.676: Q6.C 89.66,57.15 88.9,57.91 R24.2 R23.1
N$38
  Bottom 1.676: 104.14,69.85 R7.1 C24.2 94.74,69.34 33.53,69.34 R11.1 | 104.14,69.85 C20.+ | 104.14,69.85 Q20.E 108.84,78.36 109.22,78.74 109.22,86.36 100.33,86.36 | 100.33,86.36 100.33,93.98 C37.+ D10.C 99.06,104.14 Q24.C | 100.33,86.36 Q22.C
N$39
  Bottom 1.676: C21.2 10.29,72.39 R12.1 24.13,72.39 | R9.1 R10.1 45.72,72.39 | 24.13,72.39 C22.2 | 24.13,72.39 30.48,72.39 | 30.48,72.39 38.1,72.39 | 38.1,72.39 41.91,72.39 | 41.91,72.39 43.18,72.39 | 43.18,72.39 C18.+ | 43.18,72.39 45.72,72.39 | Q9.E 25.53,91.44 C25.+ 30.48,72.39 | 38.1,72.39 D3.C | 41.91,72.39 Q10.C | Q12.C 33.02,106.68 45.72,93.98 45.72,72.39
N$40
  Bottom 1.676: R25.1 25.27,80.14 Q9.B
N$41
  Bottom 1.676: Q17.E 72.01,114.3 R35.1
  Bottom 2.54: R38.2 62.23,115.57 64.01,113.79 73.41,113.79 73.15,113.54 71.63,113.54 71.75,113.41 Q17.E
N$42
  Bottom 1.676: 25.4,115.57 R28.1 | 25.4,119.38 25.4,115.57 | 25.4,115.57 Q12.E
  Bottom 2.54: R31.2 25.4,119.38
N$43
  Bottom 1.676: R25.2 Q7.C Q10.B Q10.E
N$44
  Bottom 1.676: Q7.B 38.1,83.82 38.1,86.36 | 38.1,86.36 D3.A 38.1,88.9 C25.- | 38.1,86.36 Q11.C
N$45
  Bottom 1.676: Q11.B Q11.E 41.91,93.98 R26.2
N$46
  Bottom 1.676: Q12.B 25.78,101.6 R27.1
N$47
  Bottom 1.676: Q17.B 72.77,102.87 R34.1
N$48
  Bottom 1.676: R27.2 40.64,102.87 R29.1 39.37,104.14 Q13.C
N$49
  Bottom 1.676: R28.2 30.48,113.03 31.75,111.76 Q13.B
N$50
  Bottom 1.676: C26.- 40.64,116.84 R29.2 41.91,111.76 44.7,109.22 44.7,101.85 R30.1
N$51
  Bottom 1.676: C26.+ 36.83,115.57 35.56,114.3 Q13.E
  Bottom 2.54: C27.+ 11.18,133.6 11.18,135.64 11.43,135.89 C29.1 | C29.1 C28.+ 42.42,130.3 42.42,123.19 38.61,119.38 36.83,119.38 | C29.1 D6.C D8.C | 36.83,119.38 R31.1 | C26.+ 36.83,119.38
N$52  (1 unrouted)
  Bottom 2.54: 5.08,151.38 D9.C | 5.08,151.13 17.78,151.13 | 17.78,151.13 30.48,151.13 | 30.48,151.13 C30.2 | 17.78,151.13 D8.A | 30.48,151.13 35.56,151.13 X4.1 35.56,153.67
N$53
  Bottom 2.54: D7.C 11.43,161.29 24.13,161.29 | 24.13,161.29 40.64,161.29 X4.2 C30.1 | 24.13,161.29 D6.A
N$54
  Bottom 1.676: Q19.B 77.47,109.22 76.2,107.95 R35.2
N$55
  Bottom 1.676: Q14.B 73.66,80.9 R32.1
N$56
  Bottom 1.676: R36.1 R34.2 80.01,105.41 Q19.C
N$57
  Bottom 1.676: R32.2 Q18.C Q16.C
N$58
  Bottom 1.676: Q18.B 83.82,85.09 85.09,86.36 D13.C 85.09,92.71 | C32.+ 83.82,92.71 85.09,92.71 | 85.09,92.71 Q15.E Q15.B
N$59
  Bottom 1.676: R33.2 85.09,97.79 Q15.C
N$60
  Bottom 1.676: R38.1 C31.- Q19.E | 55.88,125.73 C33.- 58.17,125.48 58.42,125.73
  Bottom 2.54: 58.17,125.48 57.4,125.48 57.15,125.73 48.51,125.73 46.99,127.25 D5.A D4.A | 58.42,125.73 C35.1 77.47,125.73 | 77.47,125.73 C34.- | 77.47,125.73 R38.1
N$61
  Bottom 1.676: R37.1 R36.2 83.82,116.84 C31.+
N$62
  Bottom 1.676: J4.1 R19.2 62.48,53.59 Q4.E 62.48,58.17 R9.2
N$63
  Bottom 2.54: D4.C 53.34,161.29 66.04,161.29 | 66.04,161.29 D2.A | 66.04,161.29 81.28,161.29 X5.1 C36.2
N$64
  Bottom 2.54: D5.C 46.99,149.86 59.69,149.86 | 59.69,149.86 71.12,149.86 | 71.12,149.86 76.2,149.86 X5.2 | 71.12,149.86 C36.1 | 59.69,149.86 D1.A
N$65
  Bottom 1.676: R39.1 105.41,90.17 104.52,89.28 Q20.B
N$66
  Bottom 1.676: Q22.E Q22.B | Q22.E R39.2 | Q22.E Q21.C
N$67
  Bottom 1.676: Q21.B C37.- Q23.C 95.25,107.95 D10.A
N$68
  Bottom 1.676: Q23.B Q23.E 92.71,115.26 R40.2
N$69
  Bottom 1.676: R42.1 115.57,119.38 111.76,115.57 111.25,115.57 111,115.57 110.49,115.57 | Q24.E 104.52,99.06
  Bottom 2.54: 111,115.57 R45.2 | 104.52,99.06 104.77,98.81 108.71,98.81 111.25,101.35 111.25,115.57
N$70
  Bottom 1.676: R41.1 101.98,109.6 Q24.B
N$71
  Bottom 1.676: R43.1 98.1,115.57 R41.2 104.14,119.38 107.44,119.38 Q8.C
N$73
  Bottom 1.676: R43.2 93.67,121.92 93.98,121.92 | 93.98,121.92 C38.- | 93.98,121.92 R44.1
N$74
  Bottom 1.676: C38.+ 105.41,124.46 107.44,124.46 Q8.E | 107.44,124.97 Q8.E | Q8.E 107.95,124.46 109.22,124.46 108.97,124.71 Q8.E
  Bottom 2.54: R45.1 123.19,118.11 123.19,124.97 | 123.19,124.97 C39.+ C40.+ | D14.C D11.C 107.44,124.97 123.19,124.97
N$75
  Bottom 1.676: D15.C D14.A
  Bottom 2.54: X6.1 86.36,144.78 87.63,143.51 91.44,143.51 | 91.44,143.51 D15.C | C42.2 91.44,143.51
N$76
  Bottom 1.676: 105.16,143.51 D12.C
  Bottom 2.54: 91.44,152.15 C42.1 | 91.44,152.15 X6.2 | D11.A 105.16,143.51 105.41,143.76 105.41,149.35 102.62,152.15 91.44,152.15
(copper drawn outside any net)
  shapes: Bottom area x136, Bottom circle x208